# Altium project BooMo_ConV2.0.PrjPcb
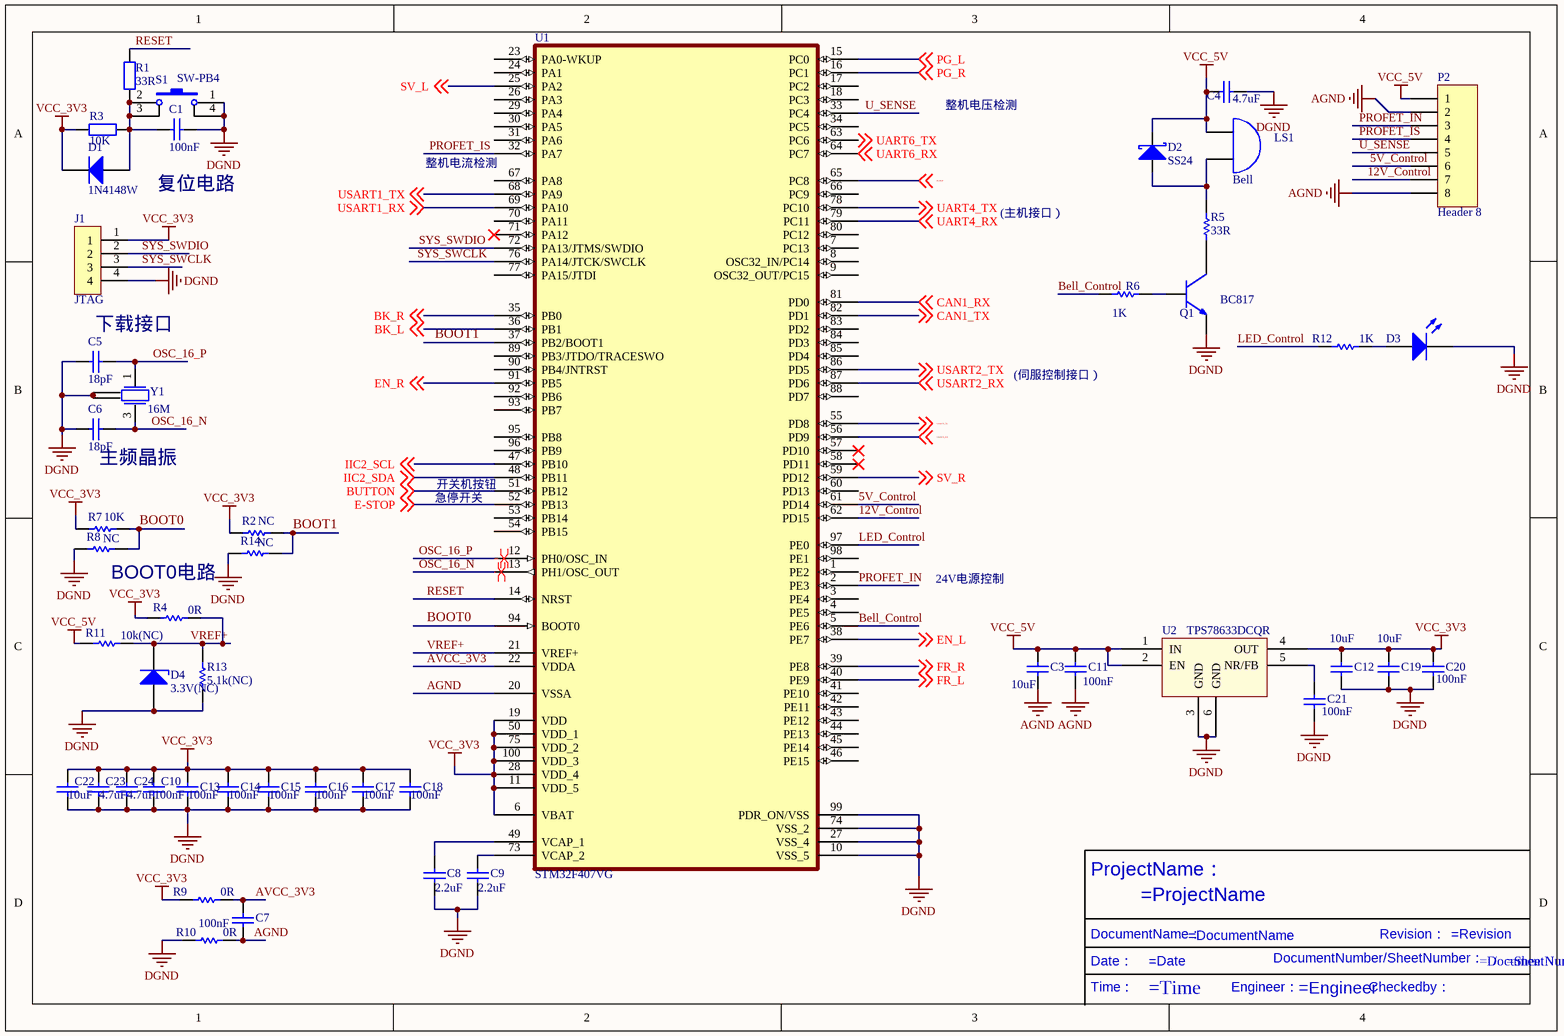
[diagram p0: Mcu.SchDoc]
3 sheets, 132 parts. Net scope: global (net labels, ports and power ports of the same name join across sheets).
Board file: BooMo_ConV2.0.PcbDoc
Sheets:
  Mcu.SchDoc
  Connector.SchDoc
  Motor Control.SchDoc

## Sheet Mcu.SchDoc
size A4

### Parts
C1  value 100nF  [C-RAD-0805]  (hidden comment: 100nF/±10%/50Vdc)
C3  value 10uF  [C-RAD-0805]  (hidden comment: 10uF/±10%/50Vdc)
C4  value 4.7uF  [C-RAD-0805]  (hidden comment: 4.7uF/±10%/50Vdc)
C5  value 18pF  [C-RAD-0805]  (hidden comment: 18pF/±10%/25Vdc)
C6  value 18pF  [C-RAD-0805]  (hidden comment: 18pF/±10%/25Vdc)
C7  value 100nF  [C-RAD-0805]  (hidden comment: 100nF/±10%/50Vdc)
C8  value 2.2uF  [C-RAD-0805]  (hidden comment: 2.2uF/±10%/50Vdc)
C9  value 2.2uF  [C-RAD-0805]  (hidden comment: 2.2uF/±10%/50Vdc)
C10  value 100nF  [C-RAD-0805]  (hidden comment: 100nF/±10%/50Vdc)
C11  value 100nF  [C-RAD-0805]  (hidden comment: 100nF/±10%/50Vdc)
C12  value 10uF  [C-RAD-0805]  (hidden comment: 10uF/±10%/50Vdc)
C13  value 100nF  [C-RAD-0805]  (hidden comment: 100nF/±10%/50Vdc)
C14  value 100nF  [C-RAD-0805]  (hidden comment: 100nF/±10%/50Vdc)
C15  value 100nF  [C-RAD-0805]  (hidden comment: 100nF/±10%/50Vdc)
C16  value 100nF  [C-RAD-0805]  (hidden comment: 100nF/±10%/50Vdc)
C17  value 100nF  [C-RAD-0805]  (hidden comment: 100nF/±10%/50Vdc)
C18  value 100nF  [C-RAD-0805]  (hidden comment: 100nF/±10%/50Vdc)
C19  value 10uF  [C-RAD-0805]  (hidden comment: 10uF/±10%/50Vdc)
C20  value 100nF  [C-RAD-0805]  (hidden comment: 100nF/±10%/50Vdc)
C21  value 100nF  [C-RAD-0805]  (hidden comment: 100nF/±10%/50Vdc)
C22  value 10uF  [C-RAD-0805]  (hidden comment: 10uF/±10%/50Vdc)
C23  value 4.7uF  [C-RAD-0805]  (hidden comment: 4.7uF/±10%/50Vdc)
C24  value 4.7uF  [C-RAD-0805]  (hidden comment: 4.7uF/±10%/50Vdc)
D1  1N4148W  [DIODE-1206]
D2  value SS24  [DIODE-SMA]  (hidden comment: Diode-Schottky)
D3  LED0  [LED_0805]  (value not drawn)
D4  value 3.3V(NC)  [DIODE-1206]  (hidden comment: Diode-Z)
J1  JTAG  [PORT-SIP4-2.54]
LS1  Bell  [PIN2]
P2  Header 8  [SM08B-PBV]
Q1  BC817  [SOT-23_N]
R1  value 33R  [0805-1]  (hidden comment: 33R 5% 1/16W 0805)
R2  value NC  [0805-1]  (hidden comment: 10K 5% 1/16W 0805(NC))
R3  value 10K  [0805-1]  (hidden comment: 10K 5% 1/16W 0805)
R4  value 0R  [0805-1]  (hidden comment: 0R 5% 1/16W 0805(NC))
R5  value 33R  [0805-1]  (hidden comment: 33R 5% 1/16W 0805)
R6  value 1K  [0805-1]  (hidden comment: 1K 5% 1/16W 0805)
R7  value 10K  [0805-1]  (hidden comment: 10K 5% 1/16W 0805)
R8  value NC  [0805-1]  (hidden comment: 10K 5% 1/16W 0805(NC))
R9  value 0R  [0805-1]  (hidden comment: 0R 5% 1/16W 0805)
R10  value 0R  [0805-1]  (hidden comment: 0R 5% 1/16W 0805)
R11  value 10k(NC)  [0805-1]  (hidden comment: 10K 5% 1/16W 0805(NC))
R12  value 1K  [0805-1]  (hidden comment: 1K 5% 1/16W 0805)
R13  value 5.1k(NC)  [0805-1]  (hidden comment: 5.1K 5% 1/16W 0805(NC))
R14  value NC  [0805-1]  (hidden comment: 10K 5% 1/16W 0805(NC))
S1  SW-PB4  [RESET-SMD-1O4]
U1  STM32F407VG  [100T1_N]
U2  TPS78633DCQR  [SOT-223-G6]
Y1  value 16M  [EPSON-16M]  (hidden comment: XTAL-16M)

### Nets
AGND: C3.1 C7.1 C11.1 P2.2 P2.8 R10.1 U1.20(VSSA)
DGND: C1.1 C4.1 C5.1 C6.2 C8.2 C9.2 C10.2 C12.1 C13.2 C14.2 C15.2 C16.2 C17.2 C18.2 C19.1 C20.1 C21.1 C22.2 C23.2 C24.2 D3.2(K) D4.1(A) J1.4 Q1.2(E) R8.2 R10.2 R13.1 R14.2 S1.1 S1.4 U1.10(VSS_5) U1.27(VSS_4) U1.74(VSS_2) U1.99(PDR_ON/VSS) U2.3(GND) U2.6(GND) Y1.2 Y1.4
VCC_3V3: C10.1 C12.2 C13.1 C14.1 C15.1 C16.1 C17.1 C18.1 C19.2 C20.2 C22.1 C23.1 C24.1 D1.2(K) J1.1 R2.1 R3.2 R4.2 R7.1 R9.2 U1.6(VBAT) U1.11(VDD_5) U1.19(VDD) U1.28(VDD_4) U1.50(VDD_1) U1.75(VDD_2) U1.100(VDD_3) U2.4(OUT)
VCC_5V: C3.2 C4.2 C11.2 D2.2(K) LS1.1(A) P2.1 R11.2 U2.1(IN) U2.2(EN)
5V_Control: P2.6 U1.61(PD14)
12V_Control: P2.7 U1.62(PD15)
AVCC_3V3: C7.2 R9.1 U1.22(VDDA)
B-STOP: U1.65(PC8) ; off-sheet B-STOP
Bell_Control: R6.2 U1.5(PE6)
BK_L: U1.36(PB1) ; off-sheet BK_L
BK_R: U1.35(PB0) ; off-sheet BK_R
BOOT0: R7.2 R8.1 U1.94(BOOT0)
BOOT1: R2.2 R14.1 U1.37(PB2/BOOT1)
BUTTON: U1.51(PB12) ; off-sheet BUTTON
CAN1_RX: U1.81(PD0) ; off-sheet CAN1_RX
CAN1_TX: U1.82(PD1) ; off-sheet CAN1_TX
E-STOP: U1.52(PB13) ; off-sheet E-STOP
EN_L: U1.38(PE7) ; off-sheet EN_L
EN_R: U1.91(PB5) ; off-sheet EN_R
FR_L: U1.40(PE9) ; off-sheet FR_L
FR_R: U1.39(PE8) ; off-sheet FR_R
IIC2_SCL: U1.47(PB10) ; off-sheet IIC2_SCL
IIC2_SDA: U1.48(PB11) ; off-sheet IIC2_SDA
LED_Control: R12.2 U1.97(PE0)
OSC_16_N: C6.1 U1.13(PH1/OSC_OUT) Y1.3
OSC_16_P: C5.2 U1.12(PH0/OSC_IN) Y1.1
PG_L: U1.15(PC0) ; off-sheet PG_L
PG_R: U1.16(PC1) ; off-sheet PG_R
PROFET_IN: P2.3 U1.2(PE3)
PROFET_IS: P2.4 U1.32(PA7)
RESET: R1.1 U1.14(NRST)
SV_L: U1.25(PA2) ; off-sheet SV_L
SV_R: U1.59(PD12) ; off-sheet SV_R
SYS_SWCLK: J1.3 U1.76(PA14/JTCK/SWCLK)
SYS_SWDIO: J1.2 U1.72(PA13/JTMS/SWDIO)
U_SENSE: P2.5 U1.33(PC4)
UART4_RX: U1.79(PC11) ; off-sheet UART4_RX
UART4_TX: U1.78(PC10) ; off-sheet UART4_TX
UART6_RX: U1.64(PC7) ; off-sheet UART6_RX
UART6_TX: U1.63(PC6) ; off-sheet UART6_TX
USART1_RX: U1.69(PA10) ; off-sheet USART1_RX
USART1_TX: U1.68(PA9) ; off-sheet USART1_TX
USART2_RX: U1.87(PD6) ; off-sheet USART2_RX
USART2_TX: U1.86(PD5) ; off-sheet USART2_TX
USART3_RX: U1.56(PD9) ; off-sheet USART3_RX
USART3_TX: U1.55(PD8) ; off-sheet USART3_TX
VREF+: D4.2(K) R4.1 R11.1 R13.2 U1.21(VREF+)
NetC1_2: C1.2 D1.1(A) R1.2 R3.1 S1.2 S1.3
NetC8_1: C8.1 U1.49(VCAP_1)
NetC9_1: C9.1 U1.73(VCAP_2)
NetC21_2: C21.2 U2.5(NR/FB)
NetD2_1: D2.1(A) LS1.2(B) R5.1
NetD3_1: D3.1(A) R12.1
NetQ1_1: Q1.1(B) R6.1
NetQ1_3: Q1.3(C) R5.2

Not connected (* = marked no-connect by the designer): U1 1(PE2) 3(PE4) 4(PE5) 7(PC13) 8(OSC32_IN/PC14) 9(OSC32_OUT/PC15) 17(PC2) 18(PC3) 23(PA0-WKUP) 24(PA1) 26(PA3) 29(PA4) 30(PA5) 31(PA6) 34(PC5) 41(PE10) 42(PE11) 43(PE12) 44(PE13) 45(PE14) 46(PE15) 53(PB14) 54(PB15) 57(PD10)* 58(PD11)* 60(PD13) 66(PC9) 67(PA8) 70(PA11) 71(PA12)* 77(PA15/JTDI) 80(PC12) 83(PD2) 84(PD3) 85(PD4) 88(PD7) 89(PB3/JTDO/TRACESWO) 90(PB4/JNTRST) 92(PB6) 93(PB7) 95(PB8) 96(PB9) 98(PE1)

### Layout directives
differential pair: OSC_16_N, OSC_16_P

### Notes on the sheet
- 整机电压检测
- 整机电流检测
- 复位电路
- (主机接口）
- 下载接口
- (伺服控制接口）
- (near C6) 主频晶振
- 急停开关
- 开关机按钮
- (near R8) BOOT0电路
- 24V电源控制
- Labels drawn without touching a wire or pin: /, =Date, =DocumentName, =DocumentNumber, =Engineer, =ProjectName, =Revision, =SheetNumber, =Time, Checkedby：, Date：, DocumentName：, DocumentNumber/SheetNumber：, Engineer：, ProjectName：, Revision：, Time：

### Library data of the parts
C1 C5 C6 = Cap: 无极性电容; Published: 8-Jun-2000; LatestRevisionDate: 17-Jul-2002; LatestRevisionNote: Re-released for DXP Platform.; PackageReference: RAD-0.3; Publisher: Altium Limited; Part No: *
C3 C4 C7-C11 C13-C18 C20-C24 = Cap: Capacitor; Published: 8-Jun-2000; LatestRevisionDate: 17-Jul-2002; LatestRevisionNote: Re-released for DXP Platform.; PackageReference: RAD-0.3; Publisher: Altium Limited; PackageDescription: Radial Cap, Thru-Hole; 2 Leads; 0.3 in Pin Spacing
C12 C19 = Cap: Capacitor,33uF / ESR 1.69m /10Vdc,C2012X5R1A336M125AC; Published: 8-Jun-2000; LatestRevisionDate: 17-Jul-2002; LatestRevisionNote: Re-released for DXP Platform.; PackageReference: RAD-0.3; Publisher: Altium Limited; PackageDescription: Radial Cap, Thru-Hole; 2 Leads; 0.3 in Pin Spacing
D1 = Diode: 二极管; Type: S01575; Published: 8-Jun-2000; LatestRevisionDate: 17-Jul-2002; LatestRevisionNote: Re-released for DXP Platform.; PackageDocument: Sep-1996; PackageReference: CD1206; Publisher: Altium Limited; Code_JEDEC: DO-214-AB; Value: 1N4148W
D2 = Diode-Schottky: 肖特基二极管; Published: 8-Jun-2000; LatestRevisionDate: 17-Jul-2002; LatestRevisionNote: Re-released for DXP Platform.; PackageReference: SMB; Publisher: Altium Limited; Code_JEDEC: DO-214-AA
D3 = LED0: 发光二极管; Published: 8-Jun-2000; LatestRevisionDate: 08-Jul-2005; LatestRevisionNote: Mech Layer 1 removed.; PackageReference: LED-0; Publisher: Altium Limited
D4 = Diode-Z: 稳压二极管; Published: 8-Jun-2000; LatestRevisionDate: 17-Jul-2002; LatestRevisionNote: Re-released for DXP Platform.; PackageReference: SMB; Publisher: Altium Limited; Code_JEDEC: DO-214-AA
J1 = Conn_1*4_1
LS1 = Bell: Electrical Bell; Published: 24-Mar-1999; LatestRevisionDate: 17-Jul-2002; LatestRevisionNote: Re-released for DXP Platform.; PackageReference: PIN2; Publisher: Altium Limited
P2 = Header 8: Header, 8-Pin; LatestRevisionDate: 17-Jul-2002; LatestRevisionNote: Re-released for DXP Platform.; Publisher: Altium Limited
Q1 = mNPN: NPN 45V 功耗 310mW; Value: BC817
R1 R3 = Res1: 贴片电阻; Published: 8-Jun-2000; LatestRevisionDate: 17-Jul-2002; LatestRevisionNote: Re-released for DXP Platform.; PackageReference: AXIAL-0.4; Publisher: Altium Limited; Part No: *
R2 R4-R14 = Res1: Resistor; Published: 8-Jun-2000; LatestRevisionDate: 17-Jul-2002; LatestRevisionNote: Re-released for DXP Platform.; PackageReference: AXIAL-0.3; Publisher: Altium Limited; PackageDescription: Axial Device, Thru-Hole; 2 Leads; 0.3 in Pin Spacing
S1 = SW-PB4: 微动开关; Published: 24-Mar-1999; LatestRevisionDate: 17-Jul-2002; LatestRevisionNote: Re-released for DXP Platform.; PackageReference: SPST-2; Publisher: Altium Limited
U1 = STM32F407VG: 主控MCU
U2 = TPS78633DCQR: 3.3V稳压芯片 1.5A输出; Publisher: *; Part No: TPS78633DCQR; LatestRevisionDate: *
Y1 = XTAL-4PIN: 晶振

## Sheet Connector.SchDoc
size A4
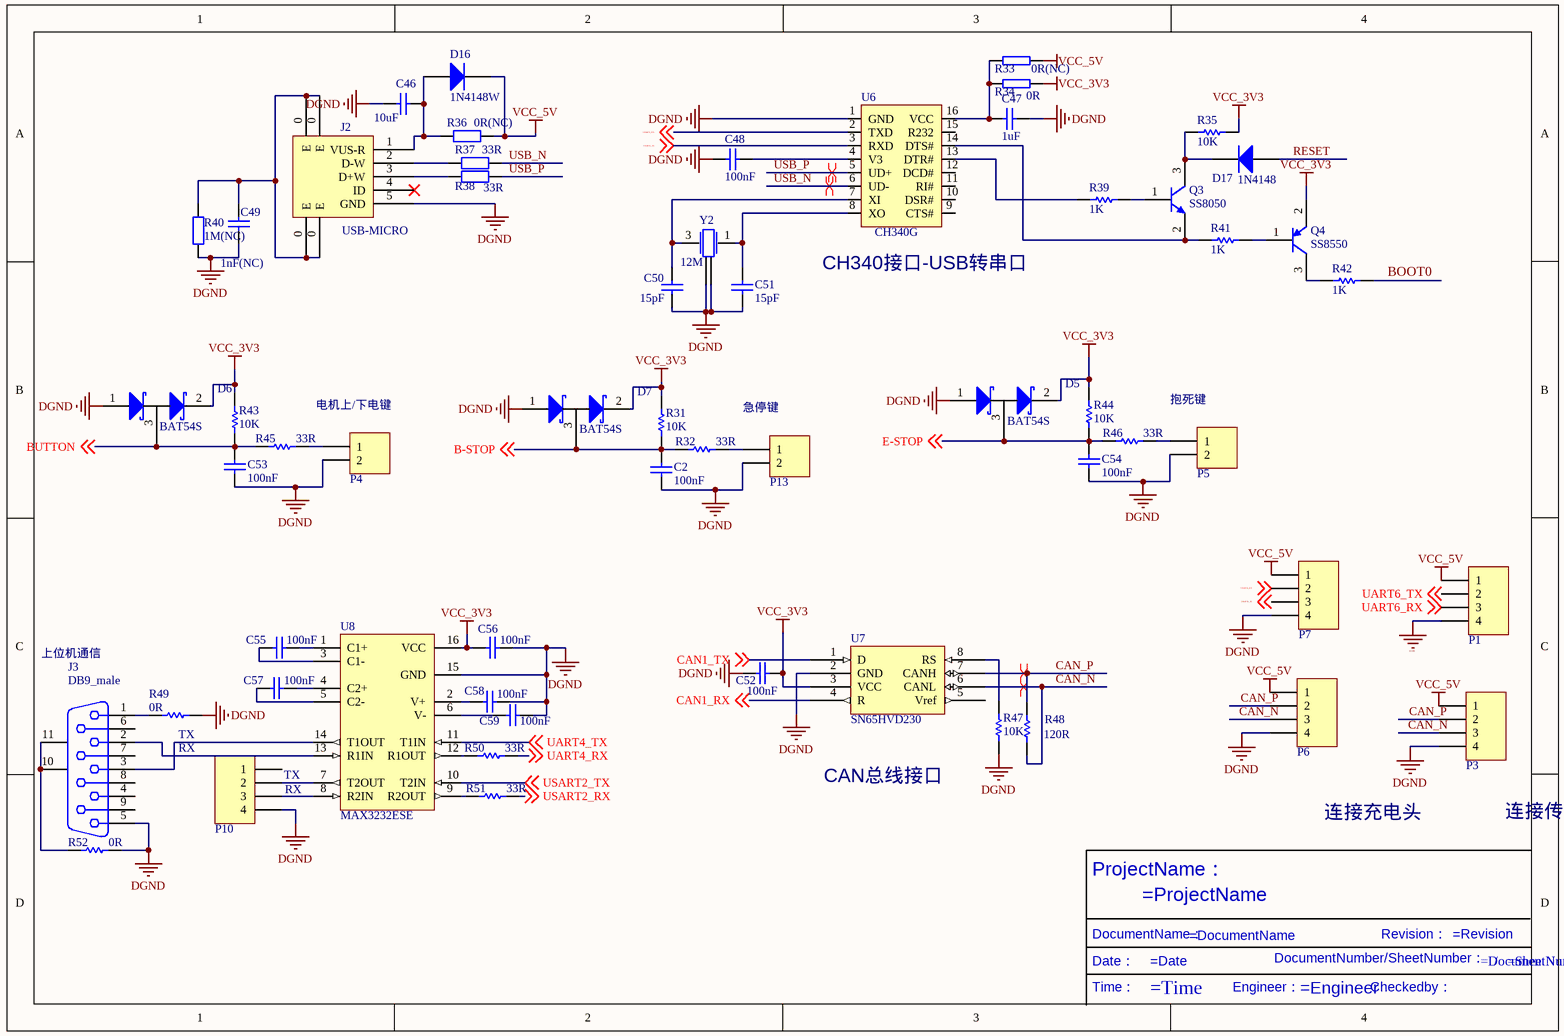
[diagram p1: Connector.SchDoc]

### Parts
C2  value 100nF  [C-RAD-0805]  (hidden comment: 100nF/±10%/50Vdc)
C46  value 10uF  [C-RAD-0805]  (hidden comment: 10uF/±10%/50Vdc)
C47  value 1uF  [C-RAD-0805]  (hidden comment: 1uF/±10%/50Vdc)
C48  value 100nF  [C-RAD-0805]  (hidden comment: 100nF/±10%/50Vdc)
C49  value 1nF(NC)  [C-RAD-0805]  (hidden comment: Cap)
C50  value 15pF  [C-RAD-0805]  (hidden comment: 15pF/±10%/50Vdc)
C51  value 15pF  [C-RAD-0805]  (hidden comment: 15pF/±10%/50Vdc)
C52  value 100nF  [C-RAD-0805]  (hidden comment: 100nF/±10%/50Vdc)
C53  value 100nF  [C-RAD-0805]  (hidden comment: 100nF/±10%/50Vdc)
C54  value 100nF  [C-RAD-0805]  (hidden comment: 100nF/±10%/50Vdc)
C55  value 100nF  [C-RAD-0805]  (hidden comment: 100nF/±10%/50Vdc)
C56  value 100nF  [C-RAD-0805]  (hidden comment: 100nF/±10%/50Vdc)
C57  value 100nF  [C-RAD-0805]  (hidden comment: 100nF/±10%/50Vdc)
C58  value 100nF  [C-RAD-0805]  (hidden comment: 100nF/±10%/50Vdc)
C59  value 100nF  [C-RAD-0805]  (hidden comment: 100nF/±10%/50Vdc)
D5  BAT54S  [SOT-23]
D6  BAT54S  [SOT-23]
D7  BAT54S  [SOT-23]
D16  1N4148W  [DIODE-1206]
D17  value 1N4148  [DIODE-1206]  (hidden comment: 1N4148W)
J2  USB-MICRO  [USB-MICRO-1]
J3  DB9_male  [DB9-M]
P1  Header 4  [SM04B-PBV]  (value not drawn)
P3  Header 4  [SM04B-PBV]  (value not drawn)
P4  Header 2  [MOLEX-2P]  (value not drawn)
P5  Header 2  [MOLEX-2P]  (value not drawn)
P6  Header 4  [SM04B-PBV]  (value not drawn)
P7  Header 4  [SM04B-PBV]  (value not drawn)
P10  Header 4  [SM04B-PBV]  (value not drawn)
P13  Header 2  [MOLEX-2P]  (value not drawn)
Q3  SS8050  [SOT-23]
Q4  SS8550  [SOT-23]
R31  value 10K  [0805-1]  (hidden comment: 10K 5% 1/16W 0805)
R32  value 33R  [0805-1]  (hidden comment: 33R 5% 1/16W 0805)
R33  value 0R(NC)  [0805-1]  (hidden comment: 0R 5% 1/16W 0805(NC))
R34  value 0R  [0805-1]  (hidden comment: 0R 5% 1/16W 0805)
R35  value 10K  [0805-1]  (hidden comment: 10K 5% 1/16W 0805)
R36  value 0R(NC)  [0805-1]  (hidden comment: 0R 5% 1/16W 0805(NC))
R37  value 33R  [0805-1]  (hidden comment: 33R 5% 1/16W 0805)
R38  value 33R  [0805-1]  (hidden comment: 33R 5% 1/16W 0805)
R39  value 1K  [0805-1]  (hidden comment: 1K 5% 1/16W 0805)
R40  value 1M(NC)  [0805-1]  (hidden comment: 1M 5% 1/16W 0805(NC))
R41  value 1K  [0805-1]  (hidden comment: 1K 5% 1/16W 0805)
R42  value 1K  [0805-1]  (hidden comment: 1K 5% 1/16W 0805)
R43  value 10K  [0805-1]  (hidden comment: 10K 5% 1/16W 0805)
R44  value 10K  [0805-1]  (hidden comment: 10K 5% 1/16W 0805)
R45  value 33R  [0805-1]  (hidden comment: 33R 5% 1/16W 0805)
R46  value 33R  [0805-1]  (hidden comment: 33R 5% 1/16W 0805)
R47  value 10K  [0805-1]  (hidden comment: 10K 5% 1/16W 0805)
R48  value 120R  [0805-1]  (hidden comment: 120R 5% 1/16W 0805)
R49  value 0R  [0805-1]  (hidden comment: 0R 5% 1/16W 0805)
R50  value 33R  [0805-1]  (hidden comment: 33R 5% 1/16W 0805)
R51  value 33R  [0805-1]  (hidden comment: 33R 5% 1/16W 0805)
R52  value 0R  [0805-1]  (hidden comment: 0R 5% 1/16W 0805)
U6  CH340G  [SOP16]
U7  SN65HVD230  [SO8-SN65HVD230]
U8  MAX3232ESE  [SOP16]
Y2  value 12M  [EPSON-16M]  (hidden comment: XTAL-12M)

### Nets
DGND: C2.2 C46.2 C47.2 C48.2 C49.2 C50.2 C51.2 C52.1 C53.2 C54.2 C56.1 C58.1 C59.1 D5.1(A) D6.1(A) D7.1(A) J2.5(GND) J3.5 P1.4 P3.4 P4.2 P5.2 P6.4 P7.4 P10.4 P13.2 R40.1 R47.2 R49.1 R52.1 U6.1(GND) U7.2(GND) U8.15(GND) Y2.2 Y2.4
VCC_3V3: C52.2 C56.2 D5.2(K) D6.2(K) D7.2(K) Q4.2(E) R31.2 R34.1 R35.1 R43.2 R44.2 U7.3(VCC) U8.16(VCC)
VCC_5V: D16.2(K) P1.1 P3.1 P6.1 P7.1 R33.1 R36.2
B-STOP: C2.1 D7.3(AK) R31.1 R32.2 ; off-sheet B-STOP
BOOT0: R42.2
BUTTON: C53.1 D6.3(AK) R43.1 R45.2 ; off-sheet BUTTON
CAN1_RX: U7.4(R) ; off-sheet CAN1_RX
CAN1_TX: U7.1(D) ; off-sheet CAN1_TX
CAN_N: P3.3 P6.3 R48.2 U7.6(CANL)
CAN_P: P3.2 P6.2 R48.1 U7.7(CANH)
E-STOP: C54.1 D5.3(AK) R44.1 R46.2 ; off-sheet E-STOP
RESET: D17.1(A)
UART4_RX: R50.2 ; off-sheet UART4_RX
UART4_TX: U8.11(T1IN) ; off-sheet UART4_TX
UART6_RX: P1.3 ; off-sheet UART6_RX
UART6_TX: P1.2 ; off-sheet UART6_TX
USART1_RX: U6.2(TXD) ; off-sheet USART1_RX
USART1_TX: U6.3(RXD) ; off-sheet USART1_TX
USART2_RX: R51.2 ; off-sheet USART2_RX
USART2_TX: U8.10(T2IN) ; off-sheet USART2_TX
USART3_RX: P7.2 ; off-sheet USART3_RX
USART3_TX: P7.3 ; off-sheet USART3_TX
USB_N: R37.2 U6.6(UD-)
USB_P: R38.2 U6.5(UD+)
NetC46_1: C46.1 D16.1(A) J2.1(VUS-R) R36.1
NetC47_1: C47.1 R33.2 R34.2 U6.16(VCC)
NetC48_1: C48.1 U6.4(V3)
NetC49_1: C49.1 J2.0(E) R40.2
NetC50_1: C50.1 U6.7(XI) Y2.3
NetC51_1: C51.1 U6.8(XO) Y2.1
NetC55_1: C55.1 U8.1(C1+)
NetC55_2: C55.2 U8.3(C1-)
NetC57_1: C57.1 U8.4(C2+)
NetC57_2: C57.2 U8.5(C2-)
NetC58_2: C58.2 U8.2(V+)
NetC59_2: C59.2 U8.6(V-)
NetD17_2: D17.2(K) Q3.3(C) R35.2
NetJ2_2: J2.2(D-W) R37.1
NetJ2_3: J2.3(D+W) R38.1
NetJ3_1: J3.1 R49.2
NetJ3_2: J3.2 U8.13(R1IN)
NetJ3_3: J3.3 U8.14(T1OUT)
NetJ3_10: J3.10(MH1) J3.11(MH2) R52.2
NetP4_1: P4.1 R45.1
NetP5_1: P5.1 R46.1
NetP10_2: P10.2 U8.7(T2OUT)
NetP10_3: P10.3 U8.8(R2IN)
NetP13_1: P13.1 R32.1
NetQ3_1: Q3.1(B) R39.1
NetQ3_2: Q3.2(E) R41.2 U6.14(DTS#)
NetQ4_1: Q4.1(B) R41.1
NetQ4_3: Q4.3(C) R42.1
NetR39_2: R39.2 U6.13(DTR#)
NetR47_1: R47.1 U7.8(RS)
NetR50_1: R50.1 U8.12(R1OUT)
NetR51_1: R51.1 U8.9(R2OUT)

Not connected (* = marked no-connect by the designer): J2 4(ID)*; J3 4 6 7 8 9; P10 1; U6 9(CTS#) 10(DSR#) 11(RI#) 12(DCD#) 15(R232); U7 5(Vref)

### Layout directives
differential pair: CAN_N, CAN_P, USB_N, USB_P

### Notes on the sheet
- (near U6) CH340接口-USB转串口
- 电机上/下电键
- 急停键
- 抱死键
- 上位机通信
- (near R49) TX
- (near R49) RX
- TX
- CAN总线接口
- RX
- 连接充电头
- 连接传感器
- Labels drawn without touching a wire or pin: /, =Date, =DocumentName, =DocumentNumber, =Engineer, =ProjectName, =Revision, =SheetNumber, =Time, Checkedby：, Date：, DocumentName：, DocumentNumber/SheetNumber：, Engineer：, ProjectName：, Revision：, Time：

### Library data of the parts
C2 C46-C59 = Cap: Capacitor; Published: 8-Jun-2000; LatestRevisionDate: 17-Jul-2002; LatestRevisionNote: Re-released for DXP Platform.; PackageReference: RAD-0.3; Publisher: Altium Limited; PackageDescription: Radial Cap, Thru-Hole; 2 Leads; 0.3 in Pin Spacing
D5-D7 = BAT54S: 双向肖特基二极管
D16 D17 = Diode: 二极管; Type: S01575; Published: 8-Jun-2000; LatestRevisionDate: 17-Jul-2002; LatestRevisionNote: Re-released for DXP Platform.; PackageDocument: Sep-1996; PackageReference: CD1206; Publisher: Altium Limited; Code_JEDEC: DO-214-AB
  D16: Value: 1N4148W
J3 = D Connector 9: 串口; PackageDocument: O; Positions: 9; Gender: Receptacle; Published: 15-Jun-2001; LatestRevisionDate: 17-Jul-2002; LatestRevisionNote: Re-released for DXP Platform.; DatasheetDocument: 1-Sep-1999; PackageReference: 788750; Publisher: Altium Limited; Orientation: Right Angle
P1 P3 P6 P7 P10 = Header 4: 接插件; LatestRevisionDate: 17-Jul-2002; LatestRevisionNote: Re-released for DXP Platform.; Publisher: Altium Limited
P4 P5 P13 = Header 2: 接插件; LatestRevisionDate: 17-Jul-2002; LatestRevisionNote: Re-released for DXP Platform.; Publisher: Altium Limited
Q3 = SS8050: NPN贴片三极管; Published: 8-Jun-2000; LatestRevisionDate: 15-Jan-2003; LatestRevisionNote: PCB Footprint 'BCY-W3/D4.7' replaced; DatasheetDocument: 1997; PackageDocument: Sep-1998; PackageReference: TO-92A; Publisher: Altium Limited; Code_JEDEC: TO-92A; ComponentLink1Description: Manufacturer Link; ComponentLink1URL: http://www.fairchildsemi.com/; ComponentLink2Description: Datasheet; ComponentLink2URL: http://www.fairchildsemi.com/ds/2N%2F2N3904.pdf
Q4 = SS8550: PNP贴片三极管; Published: 8-Jun-2000; LatestRevisionDate: 15-Jan-2003; LatestRevisionNote: PCB Footprint 'BCY-W3/D4.7' replaced; DatasheetDocument: 1997; PackageDocument: Sep-1998; PackageReference: TO-92A; Publisher: Altium Limited; Code_JEDEC: TO-92A; ComponentLink1Description: Manufacturer Link; ComponentLink1URL: http://www.fairchildsemi.com/; ComponentLink2Description: Datasheet; ComponentLink2URL: http://www.fairchildsemi.com/ds/2N%2F2N3906.pdf
R31 R32 R35 R39 R41-R52 = Res1: Resistor; Published: 8-Jun-2000; LatestRevisionDate: 17-Jul-2002; LatestRevisionNote: Re-released for DXP Platform.; PackageReference: AXIAL-0.3; Publisher: Altium Limited; PackageDescription: Axial Device, Thru-Hole; 2 Leads; 0.3 in Pin Spacing
R33 R34 = RES
R36-R38 R40 = Res1: 贴片电阻; Published: 8-Jun-2000; LatestRevisionDate: 17-Jul-2002; LatestRevisionNote: Re-released for DXP Platform.; PackageReference: AXIAL-0.4; Publisher: Altium Limited; Part No: *
U6 = CH340G: 串口转USB芯片
U7 = SN65HVD230D
U8 = MAX3232ESE: +5V Powered, Multi-Channel RS-232 Driver/Receiver; Published: 16-Jan-2001; LatestRevisionDate: 29-May-2009; LatestRevisionNote: Component Body Added.; PackageVersion: 1997; PackageReference: PE16A; Publisher: Altium Limited; PackageDescription: DIP, 16-Pin, Row Spacing 7.62 mm, Pitch 2.54 mm; Code_JEDEC: MS-001-BB; ComponentLink1Description: Manufacturer Link; ComponentLink1URL: http://www.maxim-ic.com/; ComponentLink2Description: Datasheet; ComponentLink2URL: http://pdfserv.maxim-ic.com/en/ds/MAX220-MAX249.pdf
Y2 = XTAL-4PIN: 晶振

## Sheet Motor Control.SchDoc
size A4
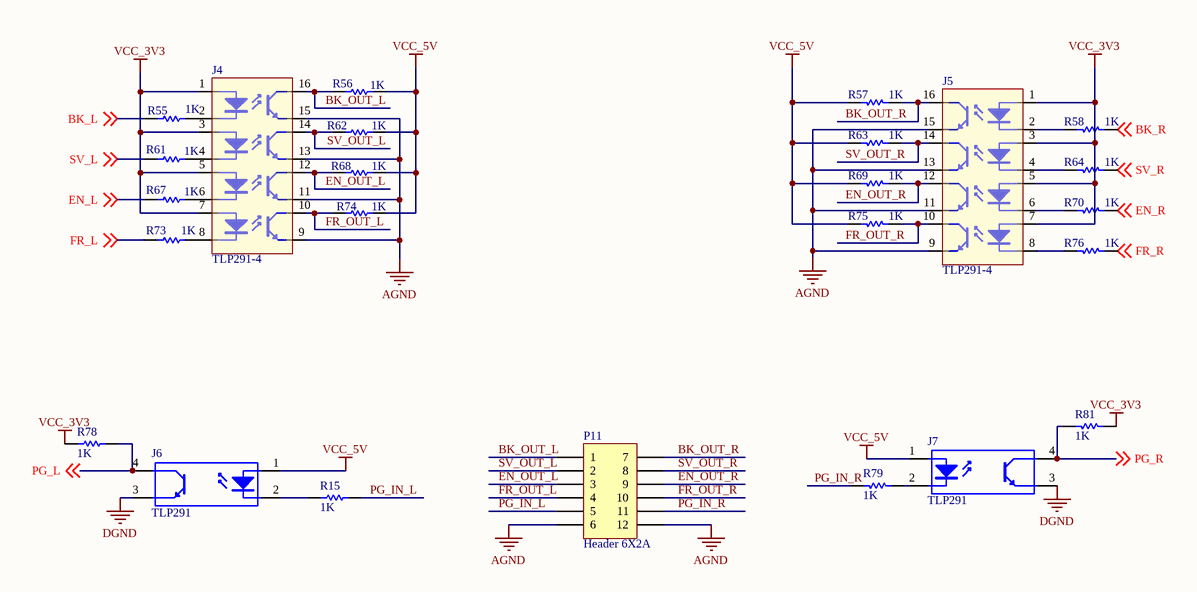
[diagram p2: Motor Control.SchDoc]

### Parts
J4  TLP291-4
J5  TLP291-4
J6  TLP291  [SOP127P710X350-4N]
J7  TLP291  [SOP127P710X350-4N]
P11  Header 6X2A  [Molex-12P]
R15  value 1K  [0805-1]  (hidden comment: 1K 5% 1/16W 0805)
R55  value 1K  [0805-1]  (hidden comment: 1K 5% 1/16W 0805)
R56  value 1K  [0805-1]  (hidden comment: 1K 5% 1/16W 0805)
R57  value 1K  [0805-1]  (hidden comment: 1K 5% 1/16W 0805)
R58  value 1K  [0805-1]  (hidden comment: 1K 5% 1/16W 0805)
R61  value 1K  [0805-1]  (hidden comment: 1K 5% 1/16W 0805)
R62  value 1K  [0805-1]  (hidden comment: 1K 5% 1/16W 0805)
R63  value 1K  [0805-1]  (hidden comment: 1K 5% 1/16W 0805)
R64  value 1K  [0805-1]  (hidden comment: 1K 5% 1/16W 0805)
R67  value 1K  [0805-1]  (hidden comment: 1K 5% 1/16W 0805)
R68  value 1K  [0805-1]  (hidden comment: 1K 5% 1/16W 0805)
R69  value 1K  [0805-1]  (hidden comment: 1K 5% 1/16W 0805)
R70  value 1K  [0805-1]  (hidden comment: 1K 5% 1/16W 0805)
R73  value 1K  [0805-1]  (hidden comment: 1K 5% 1/16W 0805)
R74  value 1K  [0805-1]  (hidden comment: 1K 5% 1/16W 0805)
R75  value 1K  [0805-1]  (hidden comment: 1K 5% 1/16W 0805)
R76  value 1K  [0805-1]  (hidden comment: 1K 5% 1/16W 0805)
R78  value 1K  [0805-1]  (hidden comment: 1K 5% 1/16W 0805)
R79  value 1K  [0805-1]  (hidden comment: 1K 5% 1/16W 0805)
R81  value 1K  [0805-1]  (hidden comment: 1K 5% 1/16W 0805)

### Nets
AGND: J4.9(E) J4.11(E) J4.13(E) J4.15(E) J5.9(E) J5.11(E) J5.13(E) J5.15(E) P11.6 P11.12
DGND: J6.3(E) J7.3(E)
VCC_3V3: J4.1(A) J4.3(A) J4.5(A) J4.7(A) J5.1(A) J5.3(A) J5.5(A) J5.7(A) R78.2 R81.2
VCC_5V: J6.1(A) J7.1(A) R56.2 R57.2 R62.2 R63.2 R68.2 R69.2 R74.2 R75.2
BK_L: R55.2 ; off-sheet BK_L
BK_OUT_L: J4.16(C) P11.1 R56.1
BK_OUT_R: J5.16(C) P11.7 R57.1
BK_R: R58.2 ; off-sheet BK_R
EN_L: R67.2 ; off-sheet EN_L
EN_OUT_L: J4.12(C) P11.3 R68.1
EN_OUT_R: J5.12(C) P11.9 R69.1
EN_R: R70.2 ; off-sheet EN_R
FR_L: R73.2 ; off-sheet FR_L
FR_OUT_L: J4.10(C) P11.4 R74.1
FR_OUT_R: J5.10(C) P11.10 R75.1
FR_R: R76.2 ; off-sheet FR_R
PG_IN_L: P11.5 R15.1
PG_IN_R: P11.11 R79.1
PG_L: J6.4(C) R78.1 ; off-sheet PG_L
PG_R: J7.4(C) R81.1 ; off-sheet PG_R
SV_L: R61.2 ; off-sheet SV_L
SV_OUT_L: J4.14(C) P11.2 R62.1
SV_OUT_R: J5.14(C) P11.8 R63.1
SV_R: R64.2 ; off-sheet SV_R
NetJ4_2: J4.2(K) R55.1
NetJ4_4: J4.4(K) R61.1
NetJ4_6: J4.6(K) R67.1
NetJ4_8: J4.8(K) R73.1
NetJ5_2: J5.2(K) R58.1
NetJ5_4: J5.4(K) R64.1
NetJ5_6: J5.6(K) R70.1
NetJ5_8: J5.8(K) R76.1
NetJ6_2: J6.2(K) R15.2
NetJ7_2: J7.2(K) R79.2

### Notes on the sheet
- Labels drawn without touching a wire or pin: /, =Date, =DocumentName, =DocumentNumber, =Engineer, =ProjectName, =Revision, =SheetNumber, =Time, Checkedby：, Date：, DocumentName：, DocumentNumber/SheetNumber：, Engineer：, ProjectName：, Revision：, Time：

### Library data of the parts
J4 J5 = TLP291-4: 光耦
J6 J7 = TLP291: 光耦; Published: 24-Mar-1999; LatestRevisionDate: 04-Mar-2005; LatestRevisionNote: Sch pins 3 & 4 Swapped.; DatasheetDocument: Nov-2003; PackageReference: DIP-4; Publisher: Altium Limited
P11 = Header 6X2A: Header, 6-Pin, Dual row; LatestRevisionDate: 17-Jul-2002; LatestRevisionNote: Re-released for DXP Platform.; Publisher: Altium Limited
R15 R55-R58 R61-R64 R67-R70 R73-R76 R78 R79 R81 = Res1: Resistor; Published: 8-Jun-2000; LatestRevisionDate: 17-Jul-2002; LatestRevisionNote: Re-released for DXP Platform.; PackageReference: AXIAL-0.3; Publisher: Altium Limited; PackageDescription: Axial Device, Thru-Hole; 2 Leads; 0.3 in Pin Spacing

## Nets that join several sheets
AGND: Mcu (7 pins), Motor Control (10 pins)
DGND: Mcu (38 pins), Connector (35 pins), Motor Control (J6.3 J7.3)
VCC_3V3: Mcu (28 pins), Connector (13 pins), Motor Control (10 pins)
VCC_5V: Mcu (9 pins), Connector (7 pins), Motor Control (10 pins)
B-STOP: Mcu (U1.65), Connector (C2.1 D7.3 R31.1 R32.2)
BK_L: Mcu (U1.36), Motor Control (R55.2)
BK_R: Mcu (U1.35), Motor Control (R58.2)
BOOT0: Mcu (R7.2 R8.1 U1.94), Connector (R42.2)
BUTTON: Mcu (U1.51), Connector (C53.1 D6.3 R43.1 R45.2)
CAN1_RX: Mcu (U1.81), Connector (U7.4)
CAN1_TX: Mcu (U1.82), Connector (U7.1)
E-STOP: Mcu (U1.52), Connector (C54.1 D5.3 R44.1 R46.2)
EN_L: Mcu (U1.38), Motor Control (R67.2)
EN_R: Mcu (U1.91), Motor Control (R70.2)
FR_L: Mcu (U1.40), Motor Control (R73.2)
FR_R: Mcu (U1.39), Motor Control (R76.2)
PG_L: Mcu (U1.15), Motor Control (J6.4 R78.1)
PG_R: Mcu (U1.16), Motor Control (J7.4 R81.1)
RESET: Mcu (R1.1 U1.14), Connector (D17.1)
SV_L: Mcu (U1.25), Motor Control (R61.2)
SV_R: Mcu (U1.59), Motor Control (R64.2)
UART4_RX: Mcu (U1.79), Connector (R50.2)
UART4_TX: Mcu (U1.78), Connector (U8.11)
UART6_RX: Mcu (U1.64), Connector (P1.3)
UART6_TX: Mcu (U1.63), Connector (P1.2)
USART1_RX: Mcu (U1.69), Connector (U6.2)
USART1_TX: Mcu (U1.68), Connector (U6.3)
USART2_RX: Mcu (U1.87), Connector (R51.2)
USART2_TX: Mcu (U1.86), Connector (U8.10)
USART3_RX: Mcu (U1.56), Connector (P7.2)
USART3_TX: Mcu (U1.55), Connector (P7.3)